# Altium schematic sheet MCU_RF.SchDoc: Titel
size A3; ApprovedBy: name; CompanyName: DCI Electronics bv; DrawnBy: KRS; Address1: Nijverheidsstraat 14; Address2: 4458 AV Eindewege; Address3: Phone: +31 (0)113 344880; DocumentNumber: 5; Revision: 1; SheetNumber: 5; SheetTotal: 14; PageSetup: Record=PageOptions|CenterHorizontal=True|CenterVertical=True|PrintScale=1.00|XCorrection=1.00|YCorrection=1.00|PrintKind=1|BorderSize=5000000|LeftOffset=0|BottomOffset=0|Orientation=2|PaperLength=1000|PaperWidth=1000|Scale=100|PaperSource=7|PrintQuality=-4|MediaType=1|DitherType=10|PaperKind=ISO_A4_(210.00_x_297.00_MM)|PrintScaleMode=1; SubTitle: SubTitel; ApprovedDate: 01-01-12; DesignedBy: KRS
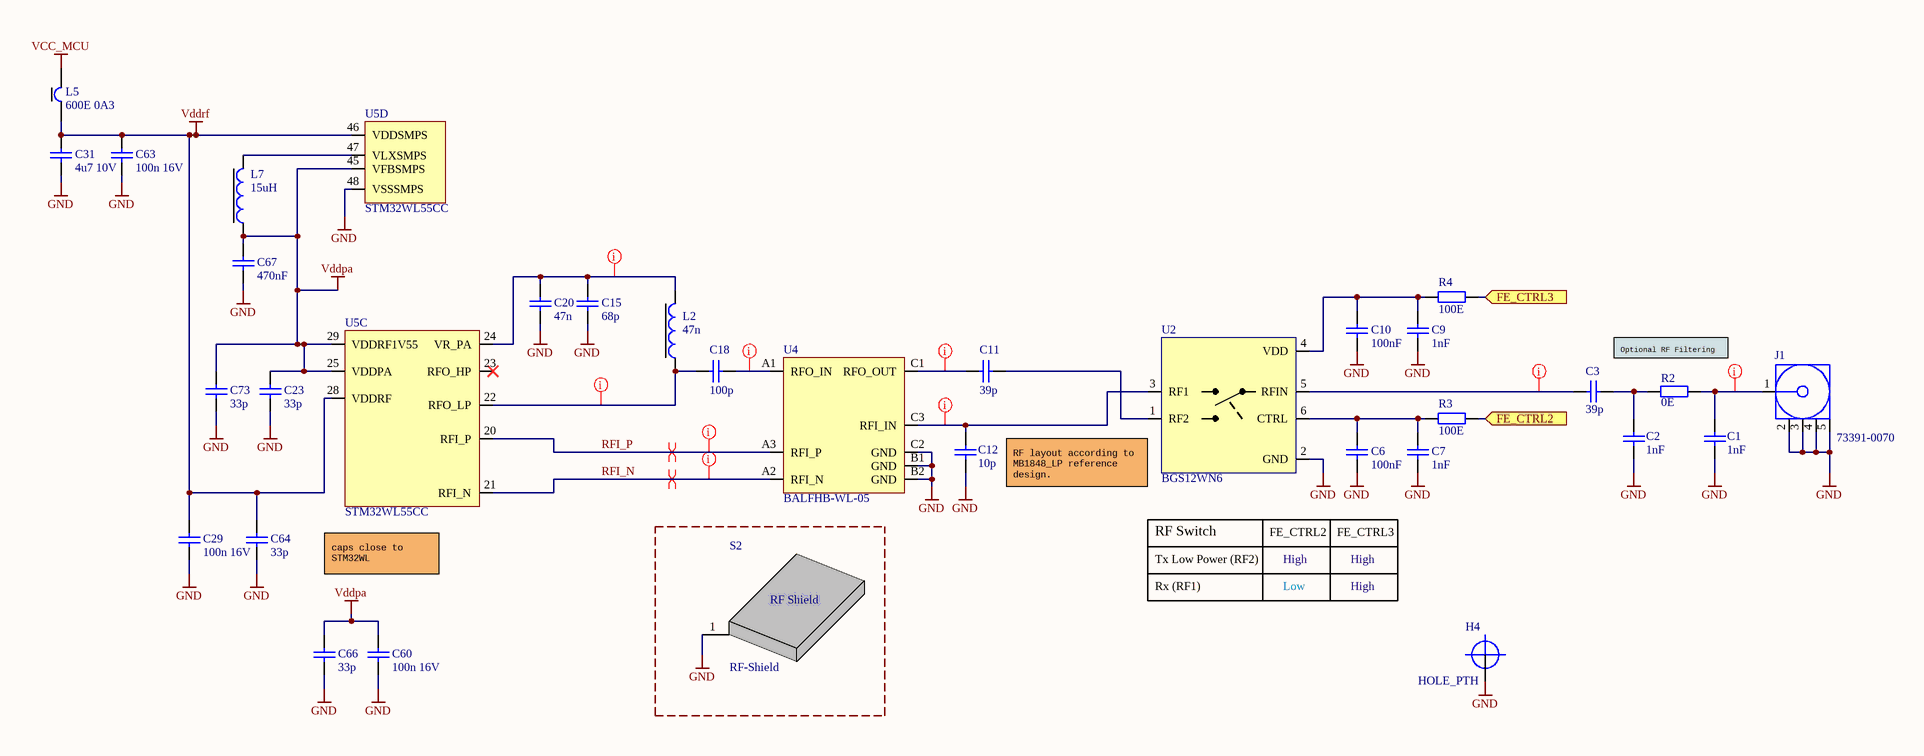
[diagram p0: MCU_RF.SchDoc]

## Parts
C1  1nF  [CAP-000G001-002]
C2  1nF  [CAP-000G001-002]
C3  39p  [CAP-000G001-002]
C6  100nF  [CAP-000G001-002]
C7  1nF  [CAP-000G001-002]
C9  1nF  [CAP-000G001-002]
C10  100nF  [CAP-000G001-002]
C11  39p  [CAP-000G001-002]
C12  10p  [CAP-000G001-002]
C15  68p  [Cap-000G002-002]
C18  100p  [CAP-000G001-002]
C20  47n  [Cap-000G002-002]
C23  33p  [CAP-000G001-002]
C29  100n 16V  [CAPC1005X05N]
C31  4u7 10V  [CAPC1608X09N]
C60  100n 16V  [CAPC1005X05N]
C63  100n 16V  [CAPC1005X05N]
C64  33p  [CAP-000G001-002]
C66  33p  [CAP-000G001-002]
C67  470nF  [CAPC1608X09N]
C73  33p  [CAP-000G001-002]
H4  HOLE_PTH  [PTH_0.8_1.5]  (no BOM)
J1  73391-0070  [AMP-SMA-132134]
L2  47n  [IND-000G002-002]
L5  600E 0A3  [INDC1608X10N]
L7  15uH  [IND-000G004-002]
R2  0E  [RES-000G001-002]
R3  100E  [RES-000G001-002]
R4  100E  [RES-000G001-002]
S2  RF-Shield  [SHLD-000G000]
U2  BGS12WN6  [DFN-400G001-006]
U4  BALFHB-WL-05  [BGA-690G001-008]
U5  STM32WL55CC  [QFN-500G000-048]  (parts C,D of 4)

## Ports
FE_CTRL2 (in), FE_CTRL3 (in)

## Nets
GND: C1.1 C2.1 C6.1 C7.1 C9.1 C10.1 C12.1 C15.1 C20.1 C23.1 C29.1 C31.1 C60.1 C63.1 C64.1 C66.1 C67.1 C73.1 H4.0 J1.2(GND) J1.3(GND) J1.4(GND) J1.5(GND) S2.1 U2.2(GND) U4.B1(GND) U4.B2(GND) U4.C2(GND) U5.48(VSSSMPS)
VCC_MCU: L5.2
Vddpa: C23.2 C60.2 C66.2 C67.2 C73.2 L7.1 U5.25(VDDPA) U5.29(VDDRF1V55) U5.45(VFBSMPS)
Vddrf: C29.2 C31.2 C63.2 C64.2 L5.1 U5.28(VDDRF) U5.46(VDDSMPS)
FE_CTRL2: R3.2 ; port FE_CTRL2
FE_CTRL3: R4.2 ; port FE_CTRL3
RFI_N: U4.A2(RFI_N) U5.21(RFI_N)
RFI_P: U4.A3(RFI_P) U5.20(RFI_P)
NetC1_2: C1.2 J1.1(Signal) R2.1
NetC2_2: C2.2 C3.1 R2.2
NetC3_2: C3.2 U2.5(RFIN)
NetC6_2: C6.2 C7.2 R3.1 U2.6(CTRL)
NetC9_2: C9.2 C10.2 R4.1 U2.4(VDD)
NetC11_1: C11.1 U4.C1(RFO_OUT)
NetC11_2: C11.2 U2.1(RF2)
NetC12_2: C12.2 U2.3(RF1) U4.C3(RFI_IN)
NetC15_2: C15.2 C20.2 L2.2 U5.24(VR_PA)
NetC18_1: C18.1 L2.1 U5.22(RFO_LP)
NetC18_2: C18.2 U4.A1(RFO_IN)
NetL7_2: L7.2 U5.47(VLXSMPS)

Not connected (* = marked no-connect by the designer): U5 23(RFO_HP)*

## Layout directives
differential pair: RFI_N, RFI_P
net class 50ohm: NetC1_2, NetC3_2, NetC11_1, NetC12_2, NetC15_2, NetC18_1, NetC18_2
net class 100R_diff: RFI_N, RFI_P

## Notes on the sheet
- Optional RF Filtering
- (near U2) RF layout according to MB1848_LP reference design.
- RF Switch
- FE_CTRL2
- FE_CTRL3
- (near U5) caps close to STM32WL
- Tx Low Power (RF2)
- Rx (RF1)
- Low
- High
- Designed by:
- Drawing number:
- Variant:
- Date:
- Page:
- Rev:
- Of:
- Dekimo Goes B.V.
- Nijverheidsstraat 14, 4458 AV  Eindewege, Phone: +31 (0)113 344880
- (in symbol MEC SHIELD) RF Shield

## Library data of the parts
C1 C2 C7 C9 = CKE 1N/90: 1nF 50V 10% X7R; EngPartGrpMainCode: CAP; ManufactpartCode: GRM033R71H102KA12D-MUR; Type: Capacitor ceramic SMD; Preferred: False; SMD_Flag: True; PartCode: CKE 1N/90
C3 C11 = CKE 39P/90: 39pF, 50V, 10%; EngPartGrpMainCode: CAP; ManufactpartCode: GRM0335C1H390JA01D-MUR; Type: Capacitor ceramic SMD; Preferred: False; SMD_Flag: True; PartCode: CKE 39P/90
C6 C10 = CKE 100N/91: 100nF, 10V, X5R; EngPartGrpMainCode: CAP; ManufactpartCode: GRM033R61A104KE15D-MUR; Type: Capacitor ceramic SMD; Preferred: False; SMD_Flag: True; PartCode: CKE 100N/91
C12 = CKE 10P/90: 10pF 50V 5% C0G/NP0; EngPartGrpMainCode: CAP; ManufactpartCode: GRM0335C1H100JA01D-MUR; Type: Capacitor ceramic SMD; Preferred: False; SMD_Flag: True; PartCode: CKE 10P/90
C15 = CKE 68P/70: 68p 5% 25V C0G NP0; EngPartGrpMainCode: CAP; ManufactpartCode: GCM1555C1H680JA16J-MUR; Type: Capacitor ceramic SMD; Preferred: False; SMD_Flag: True; PartCode: CKE 68P/70
C18 = CKE 100P/91: 100pF, 50V, C0G; EngPartGrpMainCode: CAP; ManufactpartCode: GRM0335C1H101GA01D-MUR; Type: Capacitor ceramic SMD; Preferred: False; SMD_Flag: True; PartCode: CKE 100P/91
C20 = CKE 47N/70: 47NF, 50V, 10%; EngPartGrpMainCode: CAP; ManufactpartCode: GCM155R71H473KE02J-MUR; Type: Capacitor ceramic SMD; Preferred: False; SMD_Flag: True; PartCode: CKE 47N/70
C23 C64 C66 C73 = CKE 33P/90: 33pF, 25V, 5%; EngPartGrpMainCode: CAP; ManufactpartCode: GJM0335C1E330JB01D-MUR; Type: Capacitor ceramic SMD; Preferred: False; SMD_Flag: True; PartCode: CKE 33P/90
C29 C60 C63 = CKE 100N/70: 100nF, 16V, 10%, X7R; EngPartGrpMainCode: CAP; ManufactpartCode: CC0402KRX7R7BB104-YAG; Type: Capacitor ceramic SMD; Preferred: False; SMD_Flag: True; PartCode: CKE 100N/70
C31 = CKE 4U7V10/60: 4.7uF 10% 10V X5R; EngPartGrpMainCode: CAP; ManufactpartCode: 0603ZD475KAT2A-AVX; Type: Capacitor ceramic SMD; Preferred: False; SMD_Flag: True; PartCode: CKE 4U7V10/60
C67 = CKE 470NV16/60: 470nF 16V ±10% X5R; EngPartGrpMainCode: CAP; ManufactpartCode: CC0603KRX5R7BB474-YAG; Type: Capacitor ceramic SMD; Preferred: False; SMD_Flag: True; PartCode: CKE 470NV16/60
J1 = CON SMAFS/1: SMA Fem PCB vertical; EngPartGrpMainCode: CONN; ManufactpartCode: 73391-0070-MOL; Preferred: False; PartCode: CON SMAFS/1; Type: Connector HF; SMD_Flag: False
L2 = IND 47N 0A21/70: 47n 2% 210mA; EngPartGrpMainCode: IND; ManufactpartCode: LQW15AN47NG00-MUR; Type: Inductor choke SMD; Preferred: False; SMD_Flag: True; PartCode: IND 47N 0A21/70
L5 = IND 600E 0A3/1: 600E @100Mhz 0.3A; EngPartGrpMainCode: IND; ManufactpartCode: 742792653-WE; Type: Ferrite bead SMD; Preferred: False; SMD_Flag: True; PartCode: IND 600E 0A3/1
L7 = IND 15U 0A12/1: 15uH 120mA; EngPartGrpMainCode: IND; ManufactpartCode: MLZ2012M150WT000-TDK; Type: Inductor choke SMD; Preferred: False; SMD_Flag: True; PartCode: IND 15U 0A12/1
R2 = R 0E/90: 0E 0.05W 1%; PartCode: R 0E/90; EngPartGrpMainCode: RES; ManufactpartCode: CRCW02010000Z0ED-VIS; Preferred: False; SMD_Flag: True; Type: Resistor metalfilm SMD
R3 R4 = R 100E/91: 100E 0.05W 5% 100ppm; EngPartGrpMainCode: RES; ManufactpartCode: CRCW0201100RJNED-VIS; Preferred: False; SMD_Flag: True; PartCode: R 100E/91; Type: Resistor metalfilm SMD
S2 = MEC SHIELD: PCB SMD shield; Manufacturer: Masach Tech; Manufacturer_Part_Number: MS409-10; EngPartGrpMainCode: MEC; ManufactpartCode: 2118718-2-TEC; Preferred: False; SMD_Flag: True; PartCode: MEC SHIELD; Type: Spacer SMD
U2 = IC BGS12WN6: RF-switch; Manufacturer_Part_Number: BGS12SN6; Manufacturer: INFINEON; EngPartGrpMainCode: IC; ManufactpartCode: BGS12WN6E6327XTSA1-INF; Preferred: False; SMD_Flag: True; PartCode: IC BGS12WN6; Type: IC microcontroller SMD
U4 = IC BALFHB-WL-05: Balun; Manufacturer: STMICROELECTRONICS; Manufacturer_Part_Number: IPD STM STM32WL; EngPartGrpMainCode: IC; ManufactpartCode: BALFHB-WL-05D3-STM; Preferred: False; SMD_Flag: True; PartCode: IC BALFHB-WL-05; Type: IC interface SMD
U5 = IC STM32WL55CC: EngPartGrpMainCode: IC; ManufactpartCode: STM32WL55CCU6-STM; Preferred: False; SMD_Flag: True; PartCode: IC STM32WL55CC; Type: IC microcontroller SMD